# EAGLE schematic untitled (EAGLE 8.4.3)
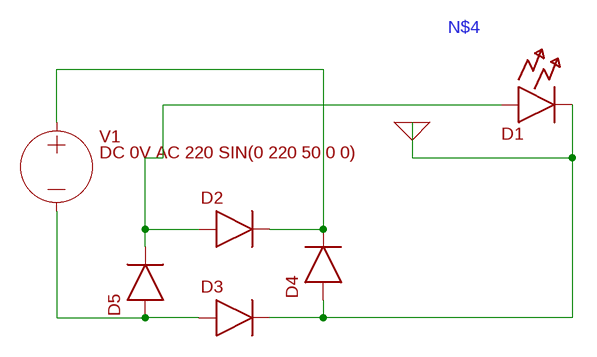
[diagram p0: schematic, sheet 1]

## Parts
D1  LED  (no package)
D2  DIODE  (no package)
D3  DIODE  (no package)
D4  DIODE  (no package)
D5  DIODE  (no package)
V1  DC 0V AC 220 SIN(0 220 50 0 0)  VOLTAGE  (no package)

## Nets
0: D1.C D3.C D4.A ; supply symbol labelled GND
N$1: D2.C D4.C V1.+
N$4: D1.A D2.A D5.C
N$7: D3.A D5.A V1.-

## Library data of the parts
D1 = ngspice-simulation:LED: Diode
D2-D5 = ngspice-simulation:DIODE: Diode
V1 = ngspice-simulation:VOLTAGE: Independent Voltage Source, either DC, AC, PULSE, SINE, PWL, EXP, or SFFM; VALUE: 0V